# EAGLE design Cхема эл.пртнц (EAGLE 9.6.2)
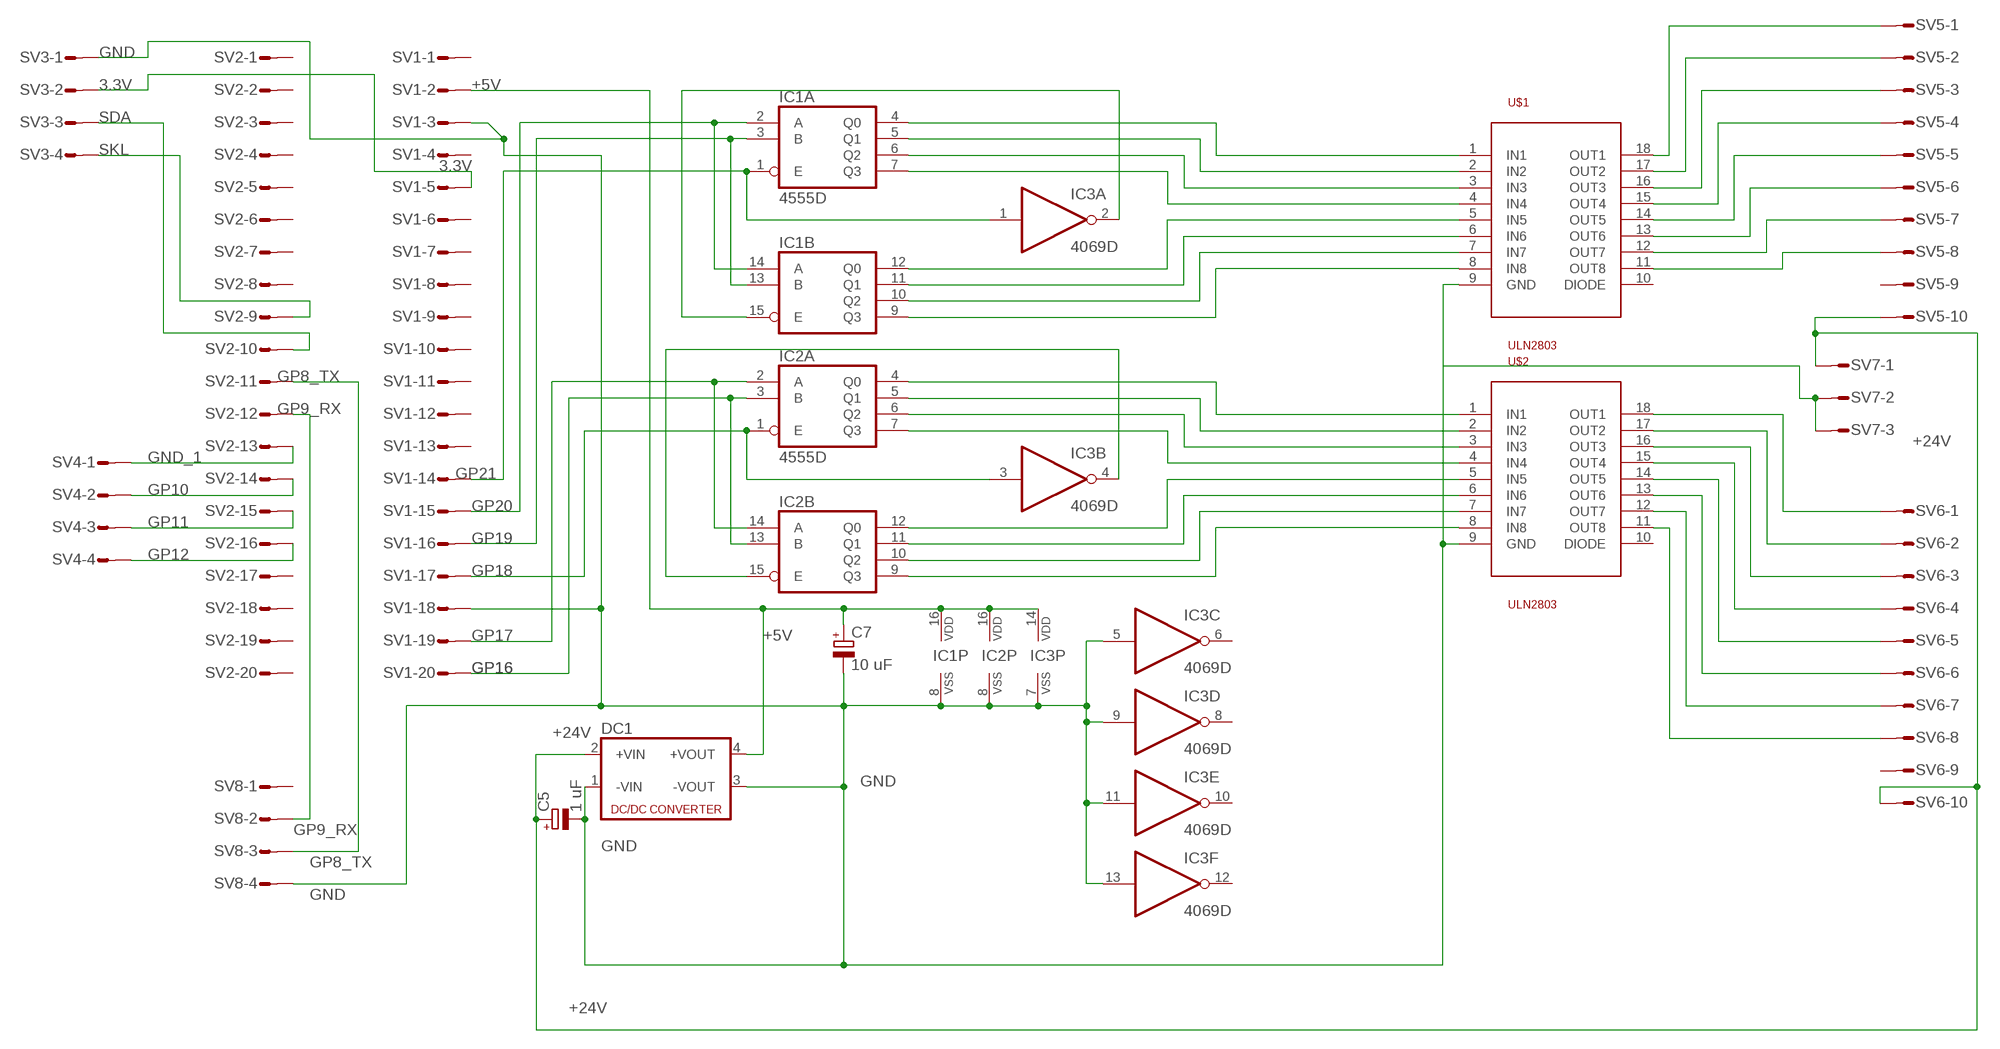
[diagram p0: schematic, sheet 1]

## Parts
C5  1 uF  CPOL-EUSMCB  [SMC_B]
C7  10 uF  CPOL-EUSMCB  [SMC_B]
DC1  NME  [NME]
IC1  4555D  [SO16]
IC2  4555D  [SO16]
IC3  4069D  [SO14]
SV1  S20P  [S20P]
SV2  S20P  [S20P]
SV3  S04P  [S04P]
SV4  S04P  [S04P]
SV5  L10P  [L10P]
SV6  L10P  [L10P]
SV7  L03P  [L03P]
SV8  S04P  [S04P]
U$1  ULN2803  [SO18L]
U$2  ULN2803  [SO18L]

## Nets
3.3V: SV1.5 SV3.2
+5V: C7.+ DC1.4(+VOUT) IC1.16(P:VDD) IC2.16(P:VDD) IC3.14(P:VDD) SV1.2
+24V: C5.+ DC1.2(+VIN) SV5.10 SV6.10 SV7.1
GND: C5.- C7.- DC1.1(-VIN) DC1.3(-VOUT) IC1.8(P:VSS) IC2.8(P:VSS) IC3.5(C:I) IC3.7(P:VSS) IC3.9(D:I) IC3.11(E:I) IC3.13(F:I) SV1.3 SV1.18 SV3.1 SV7.2 SV7.3 SV8.4 U$1.9(GND) U$2.9(GND)
GND_1: SV2.13 SV4.1
GP8_TX: SV2.11 SV8.3
GP9_RX: SV2.12 SV8.2
GP10: SV2.14 SV4.2
GP11: SV2.15 SV4.3
GP12: SV2.16 SV4.4
GP16: IC2.3(A:B) IC2.13(B:B) SV1.20
GP17: IC2.2(A:A) IC2.14(B:A) SV1.19
GP18: IC2.1(A:E) IC3.3(B:I) SV1.17
GP19: IC1.3(A:B) IC1.13(B:B) SV1.16
GP20: IC1.2(A:A) IC1.14(B:A) SV1.15
GP21: IC1.1(A:E) IC3.1(A:I) SV1.14
N$2: IC1.15(B:E) IC3.2(A:O)
N$4: IC2.15(B:E) IC3.4(B:O)
N$5: IC1.5(A:Q1) U$1.2(IN2)
N$6: IC1.6(A:Q2) U$1.3(IN3)
N$8: IC1.7(A:Q3) U$1.4(IN4)
N$9: IC1.4(A:Q0) U$1.1(IN1)
N$10: IC1.12(B:Q0) U$1.5(IN5)
N$11: IC1.11(B:Q1) U$1.6(IN6)
N$12: IC2.4(A:Q0) U$2.1(IN1)
N$13: IC2.5(A:Q1) U$2.2(IN2)
N$14: IC2.6(A:Q2) U$2.3(IN3)
N$15: IC2.7(A:Q3) U$2.4(IN4)
N$16: IC1.10(B:Q2) U$1.7(IN7)
N$17: IC1.9(B:Q3) U$1.8(IN8)
N$18: SV5.1 U$1.18(OUT1)
N$19: SV5.6 U$1.13(OUT6)
N$20: SV5.7 U$1.12(OUT7)
N$21: SV5.8 U$1.11(OUT8)
N$22: SV6.8 U$2.11(OUT8)
N$23: SV6.7 U$2.12(OUT7)
N$24: SV6.6 U$2.13(OUT6)
N$25: SV6.5 U$2.14(OUT5)
N$26: SV6.4 U$2.15(OUT4)
N$27: SV6.3 U$2.16(OUT3)
N$28: SV6.2 U$2.17(OUT2)
N$29: SV6.1 U$2.18(OUT1)
N$44: IC2.12(B:Q0) U$2.5(IN5)
N$45: IC2.11(B:Q1) U$2.6(IN6)
N$46: IC2.10(B:Q2) U$2.7(IN7)
N$47: IC2.9(B:Q3) U$2.8(IN8)
N$49: SV5.2 U$1.17(OUT2)
N$51: SV5.3 U$1.16(OUT3)
N$57: SV5.4 U$1.15(OUT4)
N$58: SV5.5 U$1.14(OUT5)
SDA: SV2.9 SV3.4
SKL: SV2.10 SV3.3
Unconnected: IC3.6(C:O) IC3.8(D:O) IC3.10(E:O) IC3.12(F:O) SV1.1 SV1.4 SV1.6 SV1.7 SV1.8 SV1.9 SV1.10 SV1.11 SV1.12 SV1.13 SV2.1 SV2.2 SV2.3 SV2.4 SV2.5 SV2.6 SV2.7 SV2.8 SV2.17 SV2.18 SV2.19 SV2.20 SV5.9 SV6.9 SV8.1 U$1.10(DIODE) U$2.10(DIODE)

## Library data of the parts
C5 C7 = rcl:CPOL-EU: POLARIZED CAPACITOR, European symbol; SPICEPREFIX: C
DC1 = dc-dc-converter:NME: DC-DC CONVERTER; MF: C & D TECHNOLOGIES, INC; MPN: NME1205D; OC_FARNELL: 1021466; OC_NEWARK: 98B8198
IC1 IC2 = 45xx:4555: Dual binary 1 of 4 DECODER/DEMULTIPLEXER
IC3 = 40xx:4069: Hex INVERTER
SV1 SV2 = con-amp-mt:S20P: AMP MT CONNECTOR; OC_FARNELL: unknown; OC_NEWARK: unknown
SV3 SV4 SV8 = con-amp-mt:S04P: AMP MT CONNECTOR; OC_FARNELL: unknown; OC_NEWARK: unknown
SV5 SV6 = con-amp-mt:L10P: AMP MT CONNECTOR; OC_FARNELL: unknown; OC_NEWARK: unknown
SV7 = con-amp-mt:L03P: AMP MT CONNECTOR; OC_FARNELL: unknown; OC_NEWARK: unknown
U$1 U$2 = uln2803:ULN2803

## Board
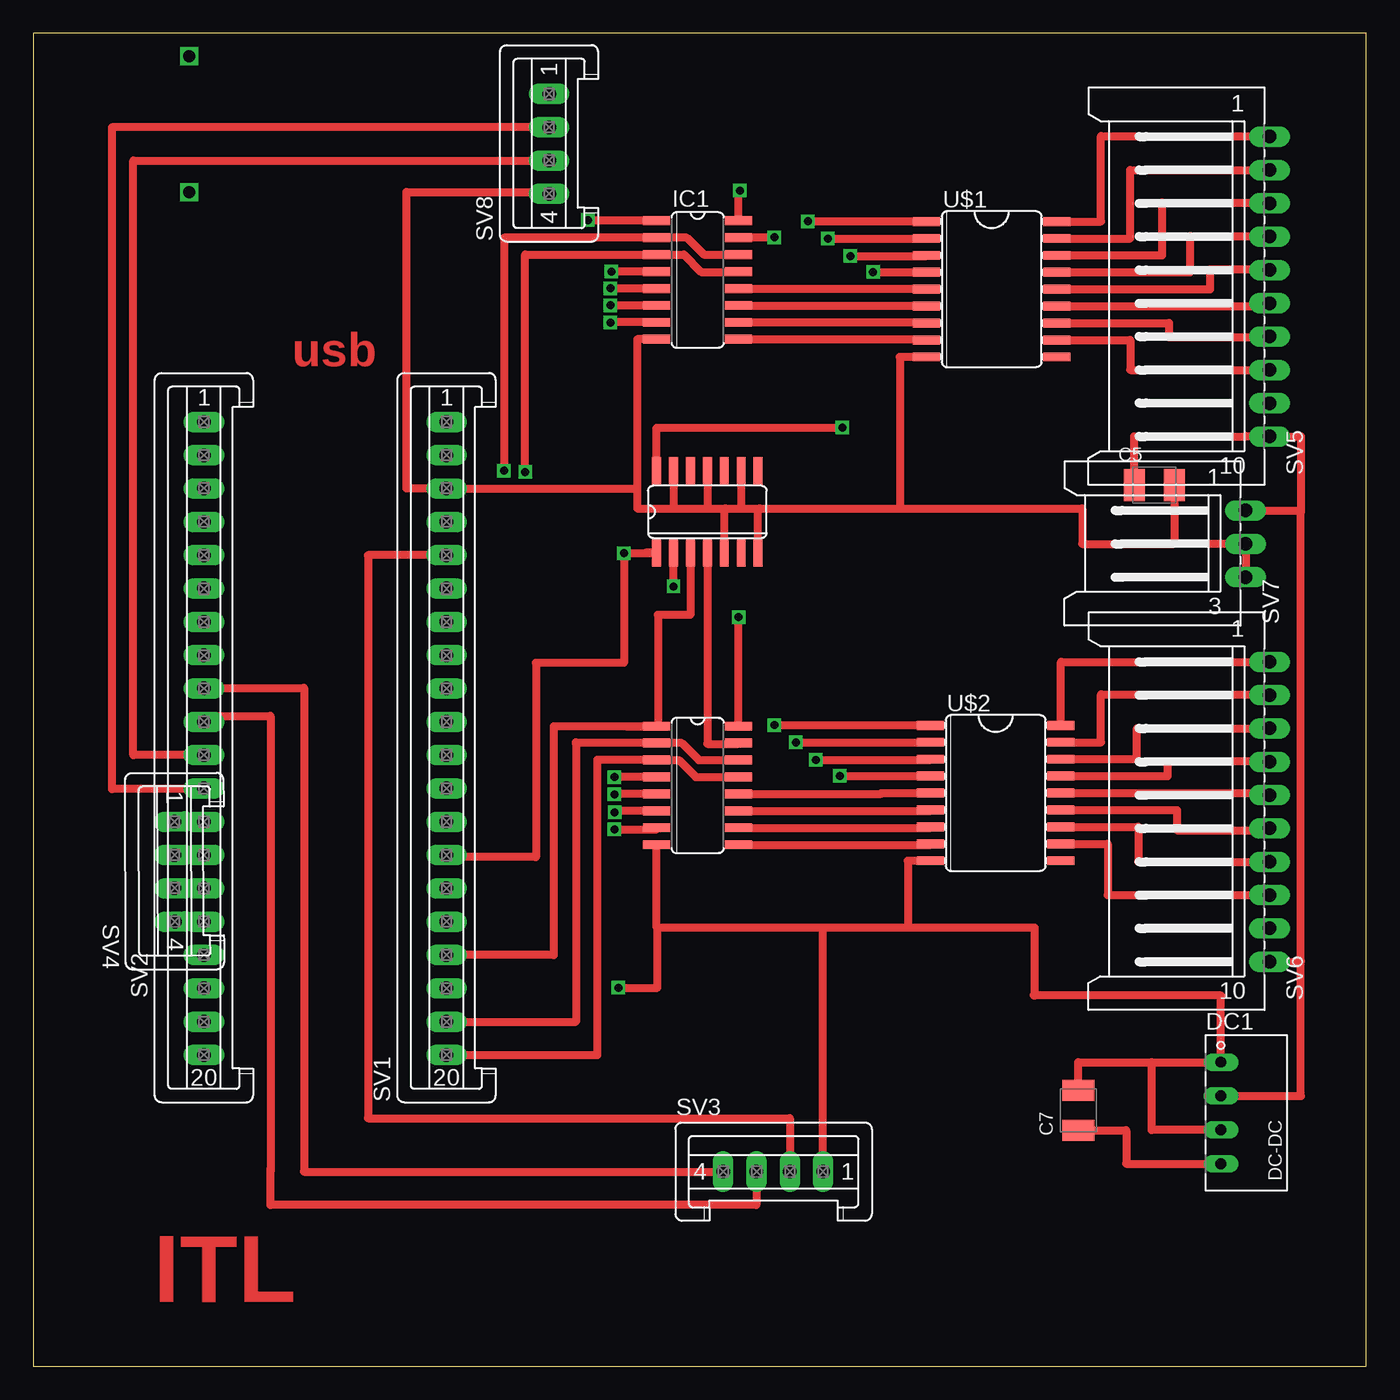
[diagram p1: board, top side]
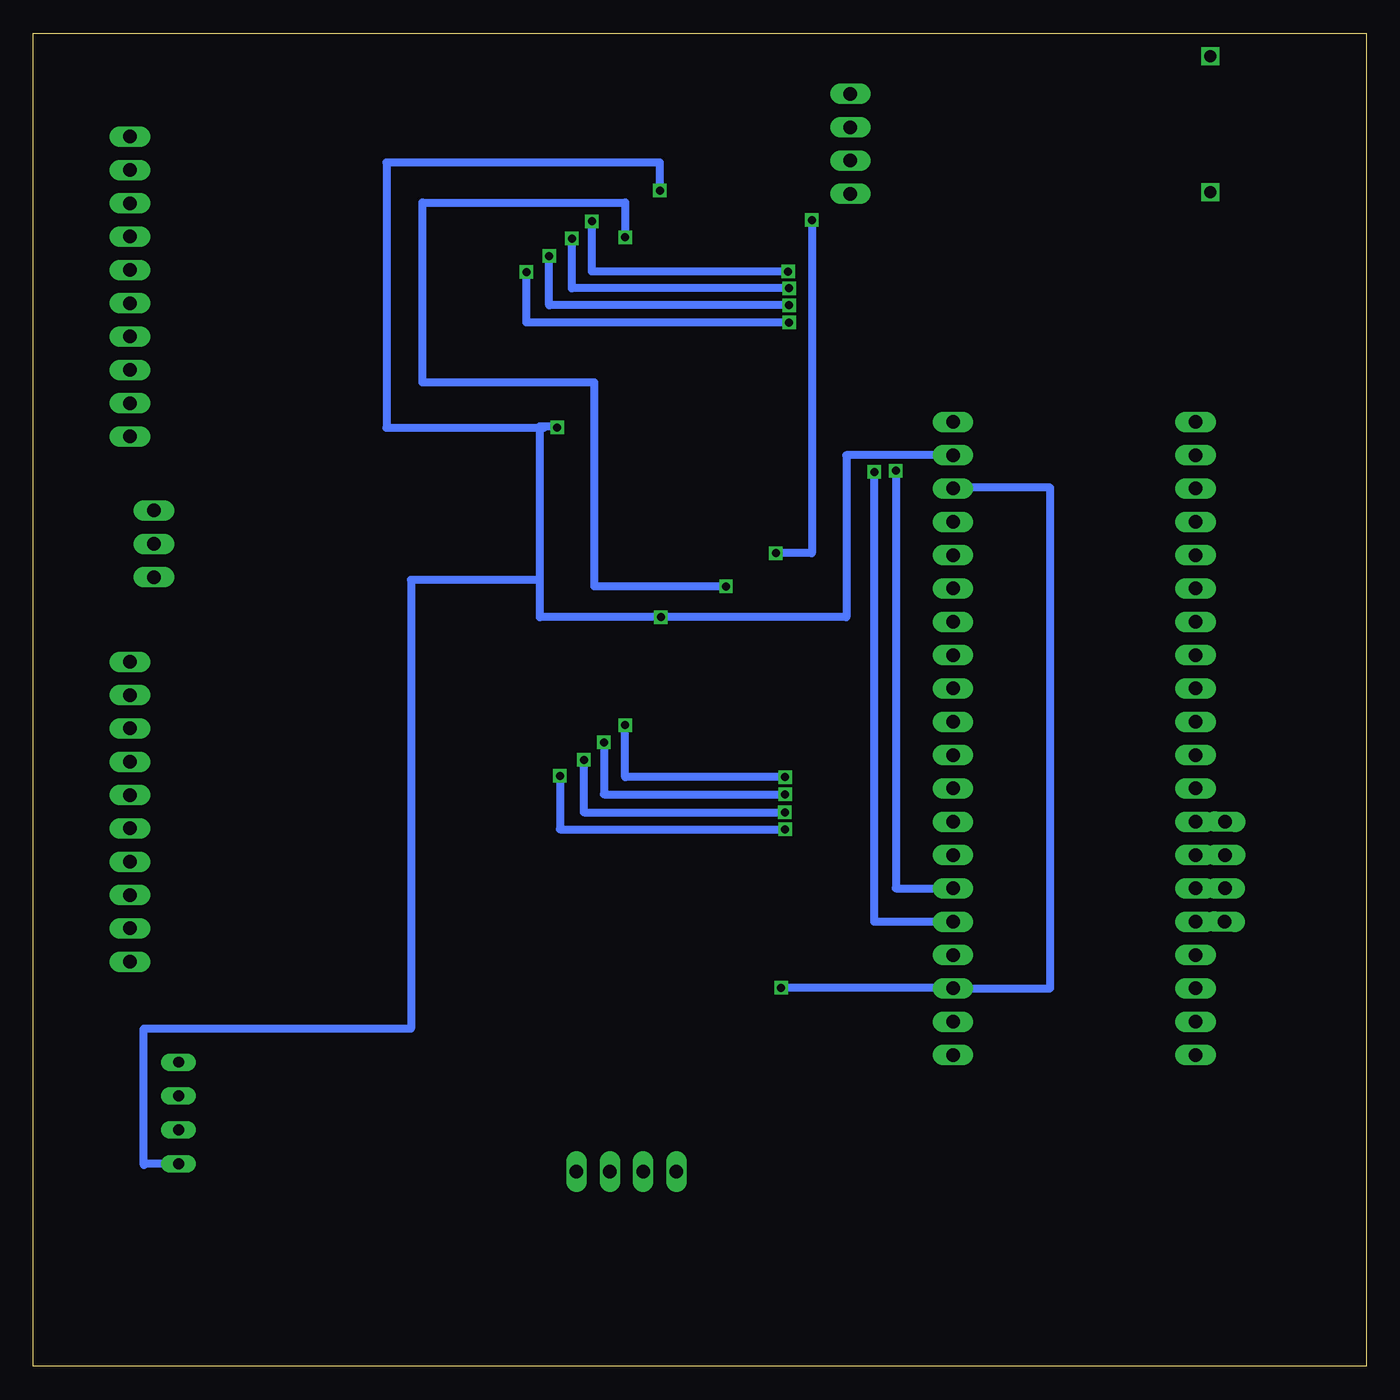
[diagram p2: board, bottom side, seen from below]

Size 100 x 100 mm. Coordinates in mm from the lower left corner, seen from the top.
Outline: 0,0 100,0 100,100 0,100 0,0
Copper layers (1*16): Top 0.035mm / dielectric 1.5mm / Bottom 0.035mm
Design rules "default": minimum track width 6mil, minimum drill 0.35mm, track to track 6mil, track to pad 6mil, pad to pad 6mil, via to via 6mil, smd to smd 6mil, copper to edge 40mil, drill to drill 6mil, minimum pad ring 10mil, minimum via ring 8mil, stop-mask expansion 4mil, vias tented up to drill 0mil, thermal gap 10mil

### Footprints (pad centres in the part's own frame; a part is rotated, then mirrored left to right if it is on the bottom)
SMC_B = smd 1.6 x 2.4: + -1.5,0; - 1.5,0
NME = drill 0.813 long: 1 0,3.81; 2 0,1.27; 3 0,-1.27; 4 0,-3.81
SO16 = smd 0.66 x 2.032: 1 -4.445,-3.073; 2 -3.175,-3.073; 3 -1.905,-3.073; 4 -0.635,-3.073; 5 0.635,-3.073; 6 1.905,-3.073; 7 3.175,-3.073; 8 4.445,-3.073; 9 4.445,3.073; 10 3.175,3.073; 11 1.905,3.073; 12 0.635,3.073; 13 -0.635,3.073; 14 -1.905,3.073; 15 -3.175,3.073; 16 -4.445,3.073
SO14 = smd 0.66 x 2.032: 1 -3.81,-3.073; 2 -2.54,-3.073; 3 -1.27,-3.073; 4 0,-3.073; 5 1.27,-3.073; 6 2.54,-3.073; 7 3.81,-3.073; 8 3.81,3.073; 9 2.54,3.073; 10 1.27,3.073; 11 0,3.073; 12 -1.27,3.073; 13 -2.54,3.073; 14 -3.81,3.073
S20P = drill 1.016 long: 1 23.75,0; 2 21.25,0; 3 18.75,0; 4 16.25,0; 5 13.75,0; 6 11.25,0; 7 8.75,0; 8 6.25,0; 9 3.75,0; 10 1.25,0; 11 -1.25,0; 12 -3.75,0; 13 -6.25,0; 14 -8.75,0; 15 -11.25,0; 16 -13.75,0; 17 -16.25,0; 18 -18.75,0; 19 -21.25,0; 20 -23.75,0
S04P = drill 1.016 long: 1 3.75,0; 2 1.25,0; 3 -1.25,0; 4 -3.75,0
L10P = drill 1.016 long: 1 11.25,-6.25; 2 8.75,-6.25; 3 6.25,-6.25; 4 3.75,-6.25; 5 1.25,-6.25; 6 -1.25,-6.25; 7 -3.75,-6.25; 8 -6.25,-6.25; 9 -8.75,-6.25; 10 -11.25,-6.25
L03P = drill 1.016 long: 1 2.5,-6.25; 2 0,-6.25; 3 -2.5,-6.25
SO18L = smd 0.66 x 2.032: 1 -5.08,-4.902; 2 -3.81,-4.902; 3 -2.54,-4.902; 4 -1.27,-4.902; 5 0,-4.902; 6 1.27,-4.902; 7 2.54,-4.902; 8 3.81,-4.902; 9 5.08,-4.902; 10 5.08,4.902; 11 3.81,4.902; 12 2.54,4.902; 13 1.27,4.902; 14 0,4.902; 15 -1.27,4.902; 16 -2.54,4.902; 17 -3.81,4.902; 18 -5.08,4.902

### Placement (x,y rotation side)
C5  84.1,66.1 0 top
C7  78.4,19.2 90 top
DC1  89.1,19 0 top
IC1  49.84,81.49 270 top
IC2  49.84,43.57 270 top
IC3  50.57,64.1 0 top
SV1  31,47.1 90 top
SV2  12.8,47.1 90 top
SV3  55.5,14.6 0 top
SV4  10.6,37.1 90.2 top
SV5  86.5,81 90 top
SV6  86.5,41.6 90 top
SV7  84.7,61.7 90 top
SV8  38.7,91.7 90 top
U$1  71.9,80.8 270 top
U$2  72.2,43 270 top

### Tracks (layer width: path | path; a pad name or v marks a point on that pad's centre or on a via)
3.3V
  Top 0.61: SV1.5 25.1,60.85 25.1,18.6 56.75,18.6 SV3.2
+5V  (via drill 0.6)
  Top 0.61: v60.7,70.43 60.7,70.4 46.76,70.4 IC3.14 | IC2.16 v52.91,56.2 | C7.+ 82,17.7 82,15.2 82.01,15.19 DC1.4 | IC1.16 52.91,88.2 v53,88.2
  Bottom 0.61: v60.7,70.43 60.6,70.53 61.7,70.53 | 62,59 62,56.2 v52.91,56.2 39,56.2 39,68.35 SV1.2 | 62,59 71.67,59 71.67,25.33 91.7,25.33 91.7,15.1 91.61,15.19 DC1.4 | 62,59 62,70.53 61.7,70.53 | v53,88.2 53,90.3 73.5,90.3 73.5,70.4 61.7,70.4 61.7,70.53
+24V
  Top 0.61: 91.4,69.8 90.9,69.8 90.95,69.75 82.6,69.75 C5.+ | 91.4,69.8 92.7,69.8 | 95.1,30.4 95,30.3 94.95,30.35 SV6.10 | 95.1,30.4 95.1,64.1 | 95.1,64.1 95,64.2 | DC1.2 95.1,20.27 95.1,30.4 | 95.1,64.2 95.1,69.75 SV5.10 91.4,69.75 91.4,69.8 | SV7.1 95.1,64.2 | 95.1,64.2 95.1,64.1
GND  (via drill 0.6)
  Top 0.61: U$1.9 65,75.72 65,64.35 | 48.05,64.35 48,64.4 48.03,64.43 IC3.13 | 48.05,64.35 50.6,64.35 | 50.6,64.35 51.9,64.35 | 51.9,64.35 53.1,64.35 | 53.1,64.35 54.5,64.35 | 54.5,64.35 65,64.35 | IC3.9 53.11,64.36 53.1,64.35 | IC3.7 54.38,64.23 54.5,64.35 | IC3.5 51.84,64.29 51.9,64.35 | IC3.11 50.57,64.38 50.6,64.35 | 65.6,32.9 75.11,32.9 75.11,27.81 | 65.6,32.9 59.25,32.9 | 59.25,32.9 46.8,32.9 | 46.8,32.9 46.77,32.93 IC2.8 | 46.8,32.9 46.8,28.4 | 46.8,28.4 46.75,28.35 | 48.05,64.35 45.3,64.35 45.3,65.85 | SV3.1 59.25,32.9 | v43.9,28.4 46.8,28.4 | IC1.8 45.3,77.05 45.3,65.85 | 39,88.25 SV8.4 38.7,88.1 28,88.1 28,65.85 SV1.3 45.3,65.85 | 75.11,27.81 75.1,27.8 75.05,27.85 | C5.- 85.6,61.72 85.58,61.7 | 75.11,27.81 89.1,27.81 DC1.1 83.9,22.81 | SV7.3 SV7.2 86.1,61.7 85.58,61.7 | C7.- 78.4,22.81 83.9,22.81 | 83.9,22.81 83.9,17.73 DC1.3 | U$2.9 65.6,37.92 65.6,32.9 | 65,64.35 78.7,64.35 78.7,61.7 85.58,61.7
  Bottom 0.61: v43.9,28.4 31,28.4 SV1.18 23.7,28.35 23.7,65.9 31,65.9 SV1.3
GND_1
  Top 0.406: SV4.1 10.59,40.97
  Top 0.61: 10.59,40.97 SV2.13
GP8_TX
  Top 0.61: SV2.11 7.5,45.85 7.5,90.45 SV8.3
  Bottom 0.61: SV2.11 12.9,45.95
GP9_RX
  Top 0.406: 12.8,43.3 SV2.12
  Top 0.61: 12.8,43.3 5.9,43.3 5.9,92.95 SV8.2
GP10
  Top 0.406: SV2.14
  Top 0.61: SV2.14 SV4.2
GP11
  Top 0.406: SV2.15
  Top 0.61: SV4.3 SV2.15
GP12
  Top 0.406: SV2.16
  Top 0.61: SV4.4 SV2.16
GP16
  Top 0.61: IC2.13 49.7,44.2 48.42,45.48 IC2.3 42.4,45.48 42.4,45.5 42.3,45.5 42.3,23.35 SV1.20
GP17
  Top 0.61: IC2.2 48.66,46.74 49.92,45.48 IC2.14 | IC2.2 | 40.7,46.74 40.7,25.85 SV1.19 | IC2.2 40.7,46.74 | 40.7,46.74 40.7,46.8
GP18
  Top 0.61: IC2.1 46.87,48.12 46.87,56.37 49.3,56.37 IC3.3 | SV1.17 31.01,30.84 39.06,30.84 39.06,48 46.77,48 IC2.1 | 44.47,48 46.77,48 IC2.1
GP19  (via drill 0.6)
  Top 0.61: IC1.13 52.89,82.1 50.1,82.1 48.8,83.39 IC1.3 36.9,83.39 v36.9,67.1
  Bottom 0.61: SV1.16 36.9,33.35 v36.9,67.1
GP20  (via drill 0.6)
  Top 0.61: IC1.14 50.3,83.39 49.03,84.67 IC1.2 35.3,84.67 v35.3,67.18
  Bottom 0.61: v35.3,67.18 35.3,35.85 SV1.15
GP21  (via drill 0.6)
  Top 0.61: SV1.14 31,38.2 37.7,38.2 37.7,52.77 44.3,52.77 v44.3,61 46.76,61 IC3.1 | 46.8,61.5 46.76,61.5 IC3.1 | IC3.1 45.96,61.03 | IC1.1 41.6,85.94 v41.6,86
  Bottom 0.61: v41.6,86 41.6,61 v44.3,61
N$1  (via drill 0.9)
  other vias: 11.7,88.1
N$2  (via drill 0.6)
  Top 0.61: v48.03,58.5 IC3.2 | v55.6,84.7 55.6,84.67 IC1.15
  Bottom 0.61: 48.13,58.4 v48.03,58.5 57.9,58.5 57.9,73.8 70.8,73.8 70.8,87.3 55.6,87.3 v55.6,84.7
N$3  (via drill 0.9)
  other vias: 11.7,98.3
N$4
  Top 0.61: IC3.4 50.57,46.7 52.87,46.7 IC2.15
N$5  (via drill 0.6)
  Top 0.61: IC1.5 43.3,80.86 v43.3,80.87 | v59.6,84.6 U$1.2
  Bottom 0.61: v43.3,80.87 59.6,80.87 v59.6,84.6
N$6  (via drill 0.6)
  Top 0.61: IC1.6 43.3,79.58 v43.3,79.6 | v61.3,83.3 67,83.3 U$1.3
  Bottom 0.61: v43.3,79.6 61.3,79.6 v61.3,83.3
N$8  (via drill 0.6)
  Top 0.61: IC1.7 43.3,78.31 v43.3,78.3 | v63,82.1 67,82.1 U$1.4
  Bottom 0.61: v43.3,78.3 63,78.3 v63,82.1
N$9  (via drill 0.6)
  Top 0.61: IC1.4 v43.37,82.12 v43.37,82.13 | U$1.1 67,85.9 v58.1,85.9
  Bottom 0.61: v43.37,82.13 58.1,82.13 v58.1,85.9
N$10
  Top 0.61: IC1.12 67,80.86 U$1.5
N$11
  Top 0.61: IC1.11 66.1,79.58 | 66.1,79.58 66.7,79.58 | U$1.6 66.1,79.53 66.1,79.58
N$12  (via drill 0.6)
  Top 0.61: IC2.4 v43.6,44.2 | v55.6,48.1 67.3,48.1 U$2.1
  Bottom 0.61: v43.6,44.2 55.6,44.2 v55.6,48.1
N$13  (via drill 0.6)
  Top 0.61: IC2.5 43.63,42.94 v43.6,42.9 | v57.2,46.8 U$2.2
  Bottom 0.61: v57.2,46.8 57.2,42.9 v43.6,42.9
N$14  (via drill 0.6)
  Top 0.61: IC2.6 43.62,41.66 v43.62,41.55 | v58.7,45.5 67.3,45.5 U$2.3
  Bottom 0.61: v43.62,41.55 58.7,41.55 v58.7,45.5
N$15  (via drill 0.6)
  Top 0.61: v43.59,40.28 46.77,40.28 IC2.7 | v60.5,44.3 67.3,44.3 U$2.4
  Bottom 0.61: v60.5,44.3 60.5,40.28 v43.59,40.28
N$16
  Top 0.61: IC1.10 67,78.31 U$1.7
N$17
  Top 0.61: IC1.9 67,77.05 U$1.8
N$18
  Top 0.61: U$1.18 80.1,85.88 80.1,92.3 92.75,92.3 SV5.1
N$19
  Top 0.61: U$1.13 92.75,79.53 SV5.6
N$20
  Top 0.61: U$1.12 85.2,78.26 85.2,77.2 92.75,77.2 SV5.7
N$21
  Top 0.61: U$1.11 82.3,76.99 82.3,74.75 SV5.8
N$22
  Top 0.61: U$2.11 80.6,39.19 80.6,35.35 SV6.8
N$23
  Top 0.61: U$2.12 82.9,40.46 82.9,37.85 SV6.7
N$24
  Top 0.61: U$2.13 85.8,41.73 85.8,40.2 92.75,40.2 SV6.6
N$25
  Top 0.61: U$2.14 92.75,43 SV6.5
N$26
  Top 0.61: U$2.15 85.1,44.27 85.1,45.4 92.75,45.4 SV6.4
N$27
  Top 0.61: U$2.16 82.8,45.54 82.8,47.85 SV6.3
N$28
  Top 0.61: U$2.17 80.1,46.81 80.1,50.4 92.75,50.4 SV6.2
N$29
  Top 0.61: U$2.18 77.1,52.85 SV6.1
N$44
  Top 0.61: IC2.12 63.6,42.94 63.6,43 U$2.5
N$45
  Top 0.61: U$2.6 67.3,41.66 IC2.11
N$46
  Top 0.61: U$2.7 67.3,40.4 IC2.10
N$47
  Top 0.61: U$2.8 67.3,39.12 IC2.9
N$49
  Top 0.61: U$1.17 82.3,84.61 82.3,89.75 SV5.2
N$51
  Top 0.61: U$1.16 84.7,83.34 84.7,87.3 92.75,87.3 SV5.3
N$57
  Top 0.61: U$1.15 86.8,82.07 86.8,84.8 92.75,84.8 SV5.4
N$58
  Top 0.61: U$1.14 88.3,80.8 88.3,82.3 92.75,82.3 SV5.5
SDA
  Top 0.406: SV2.9 12.8,50.9
  Top 0.61: 12.8,50.9 20.3,50.9 20.3,14.6 SV3.4
SKL
  Top 0.406: SV2.10 12.8,48.8
  Top 0.61: 12.8,48.8 17.8,48.8 17.8,14.8 17.8,14.6 17.8,12.1 54.25,12.1 SV3.3

### Text on the board
Top: usb | ITL